# EAGLE design linear_DC_voltage_reg (EAGLE 9.6.2)
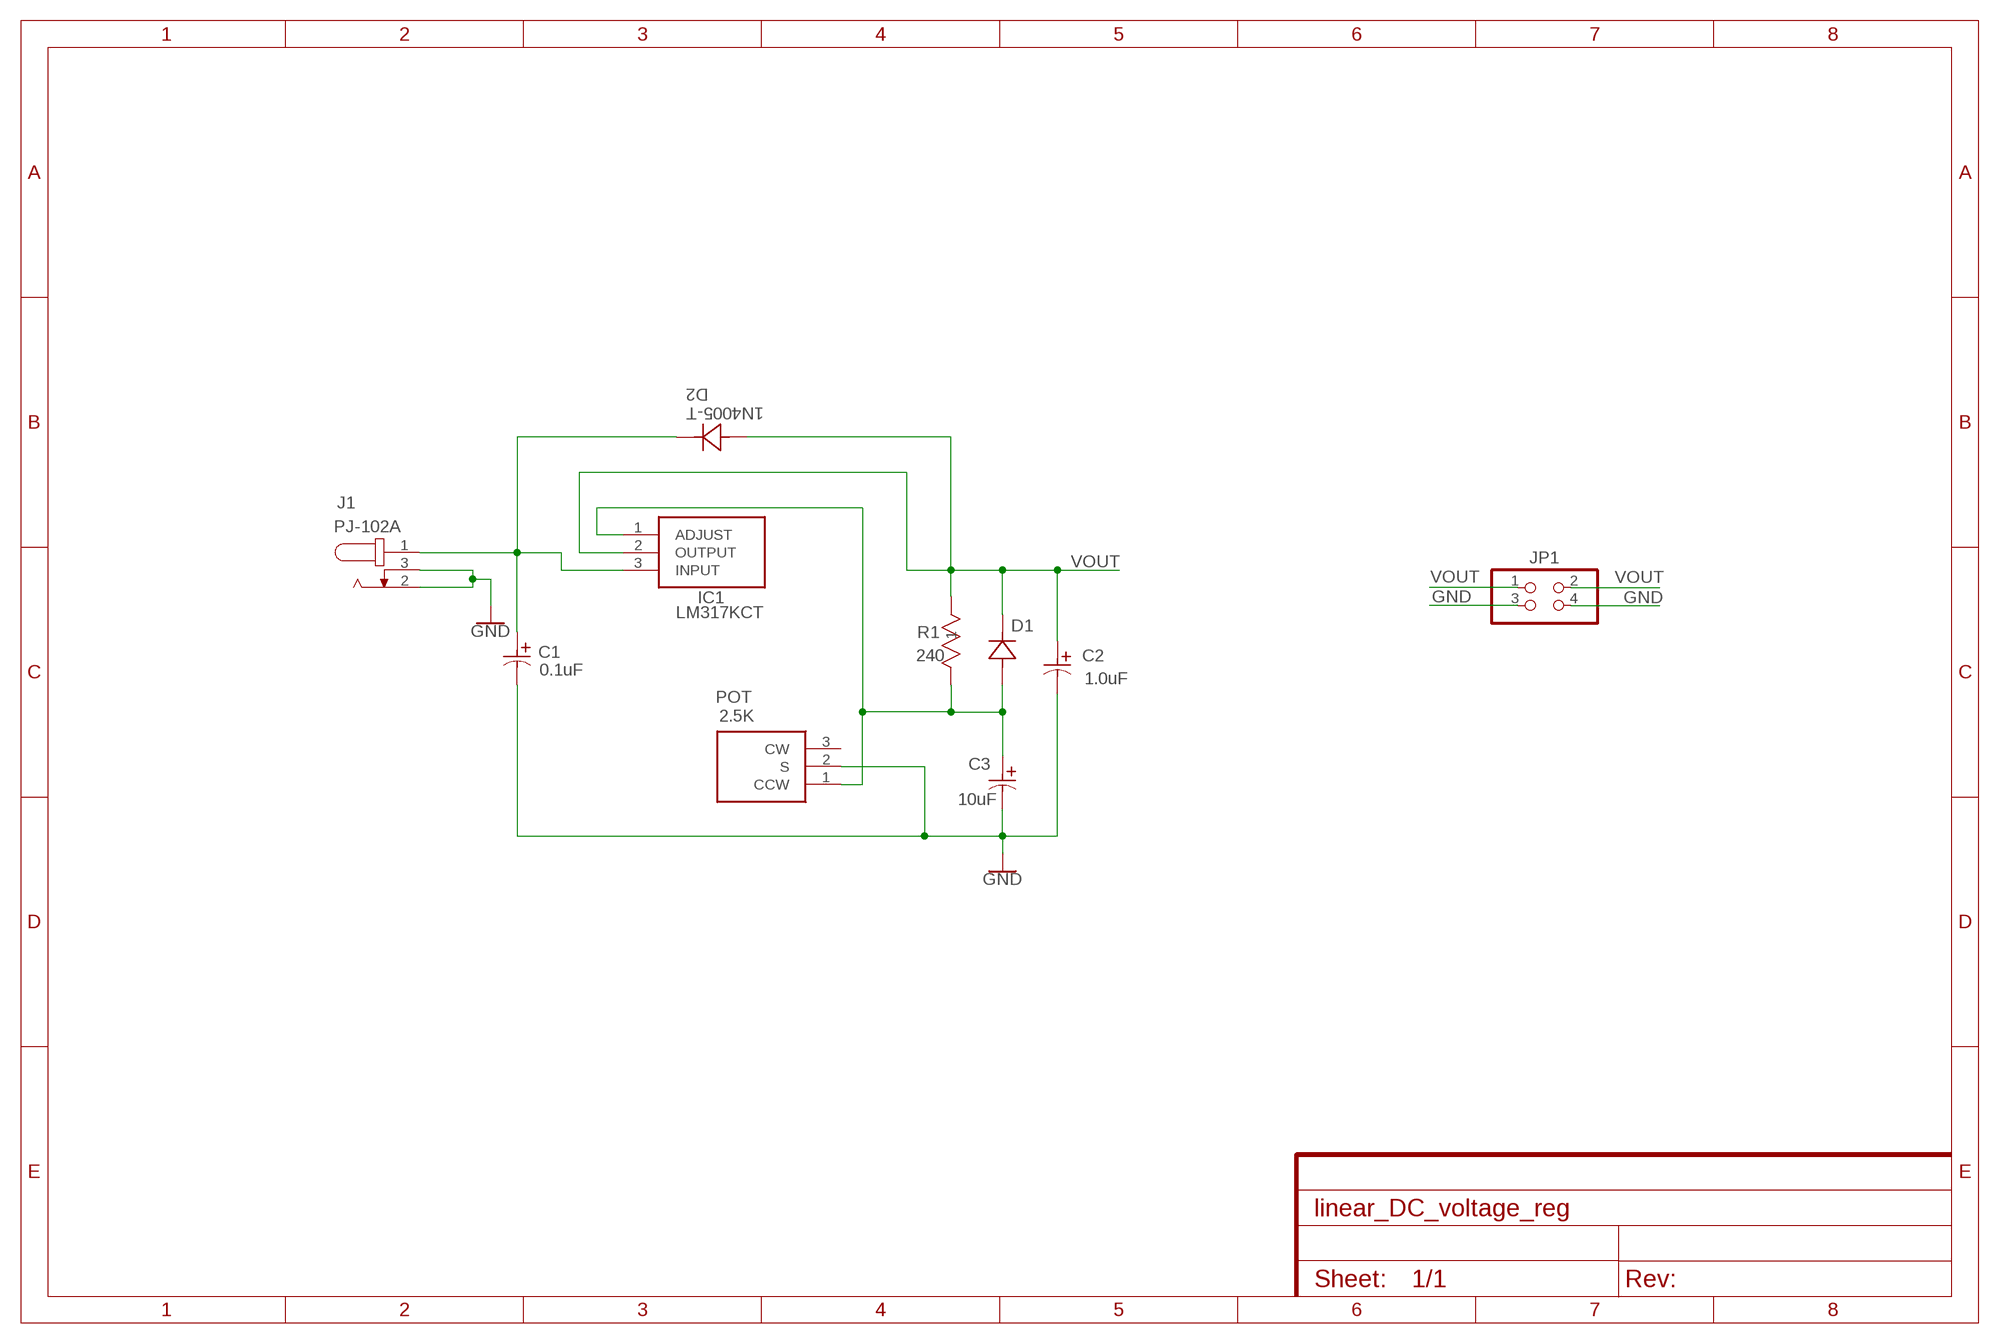
[diagram p0: schematic, sheet 1]

## Parts
C1  0.1uF  C322C104K5R5TA  [CAP_C322_KEM]
C2  1.0uF  C322C104K5R5TA  [CAP_C322_KEM]
C3  10uF  C322C104K5R5TA  [CAP_C322_KEM]
D1  1N4005-T  [DO-41_DIO]
D2  1N4005-T  [DO-41_DIO]
IC1  LM317KCT  [TO254P465X1016X1883-3P]
J1  PJ-102A  [CUI_PJ-102A]
JP1  PINHD-2X2  [2X02]
POT  2.5K  P160KN-0FC18C2K5  [P160KN0FC18C2K5]
R1  240  CFM12JT240R  [STA_CFM12_STP]

## Nets
GND: C1.2 C2.2 C3.2 J1.2 J1.3 JP1.3 JP1.4 POT.2(S)
VADJ: C3.1 D1.2 IC1.1(ADJUST) POT.1(CCW) R1.2
VIN: C1.1 D2.1 IC1.3(INPUT) J1.1
VOUT: C2.1 D1.1 D2.2 IC1.2(OUTPUT) JP1.1 JP1.2 R1.1
Unconnected: POT.3(CW)

## Library data of the parts
C1-C3 = CAP_C322:C322C104K5R5TA; COPYRIGHT: Copyright (C) 2021 Ultra Librarian. All rights reserved.; DIGI-KEY_PART_NUMBER_1: 399-4329-ND; MANUFACTURER_PART_NUMBER: C322C104K5R5TA; MFR_NAME: Kemet
D1 D2 = 1N4005_Diode:1N4005-T; COPYRIGHT: Copyright (C) 2021 Ultra Librarian. All rights reserved.; DIGI-KEY_PART_NUMBER_1: 1N4005DICT-ND; DIGI-KEY_PART_NUMBER_2: 1N4005DITR-ND; DIGI-KEY_PART_NUMBER_3: 1N4005DITR-NDL; MANUFACTURER_PART_NUMBER: 1N4005-T; MFR_NAME: Diodes Inc
IC1 = SamacSys_Parts:LM317KCT: 3-pin and 4-pin 1.5-A adjustable positive voltage regulator Source: Datasheet <http://www.ti.com/lit/gpn/lm317>; DESCRIPTION: 3-pin and 4-pin 1.5-A adjustable positive voltage regulator; HEIGHT: 4.65mm; MANUFACTURER_NAME: Texas Instruments; MANUFACTURER_PART_NUMBER: LM317KCT; MOUSER_PART_NUMBER: 595-LM317KCT; MOUSER_PRICE-STOCK: https://www.mouser.co.uk/ProductDetail/Texas-Instruments/LM317KCT?qs=TB%2FQ0sBK%2FGcz1btw204Pbw%3D%3D
J1 = barrel_jack_uno:PJ-102A: 2.0 mm Center Pin, 2.5 A, Right Angle, Through Hole, Tapered Pins, Dc Power Jack Connector; CUI_PURCHASE_URL: https://www.cuidevices.com/product/interconnect/connectors/dc-power-connectors/jacks/pj-102a?utm_source=snapeda.com&utm_medium=referral&utm_campaign=snapedaBOM; DESCRIPTION: 2.0 x 6.5 mm, 2.5 A, Horizontal, Through Hole, Tapered Pins, Dc Power Jack Connector; DIGI-KEY_PART_NUMBER: CP-102AH-ND; MF: CUI Devices; MP: PJ-102A; PACKAGE: None; PURCHASE-URL: https://pricing.snapeda.com/search/part/PJ-102A/?ref=eda
JP1 = pinhead:PINHD-2X2: PIN HEADER
POT = SamacSys_Parts:P160KN-0FC18C2K5: Potentiometers 16mm Rotary Panel Potentiometer Source: Datasheet <https://www.ttelectronics.com/TTElectronics/media/ProductFiles/Potentiometers/Datasheets/P160.pdf>; DESCRIPTION: Potentiometers 16mm Rotary Panel Potentiometer; HEIGHT: 16.5mm; MANUFACTURER_NAME: TT Electronics/BI Magnetics; MANUFACTURER_PART_NUMBER: P160KN-0FC18C2K5
R1 = res_CFM12_240:CFM12JT240R; COPYRIGHT: Copyright (C) 2021 Ultra Librarian. All rights reserved.; DIGI-KEY_PART_NUMBER_1: S240HCT-ND; DIGI-KEY_PART_NUMBER_2: S240HTR-ND; MANUFACTURER_PART_NUMBER: CFM12JT240R; MFR_NAME: Stackpole International

## Board
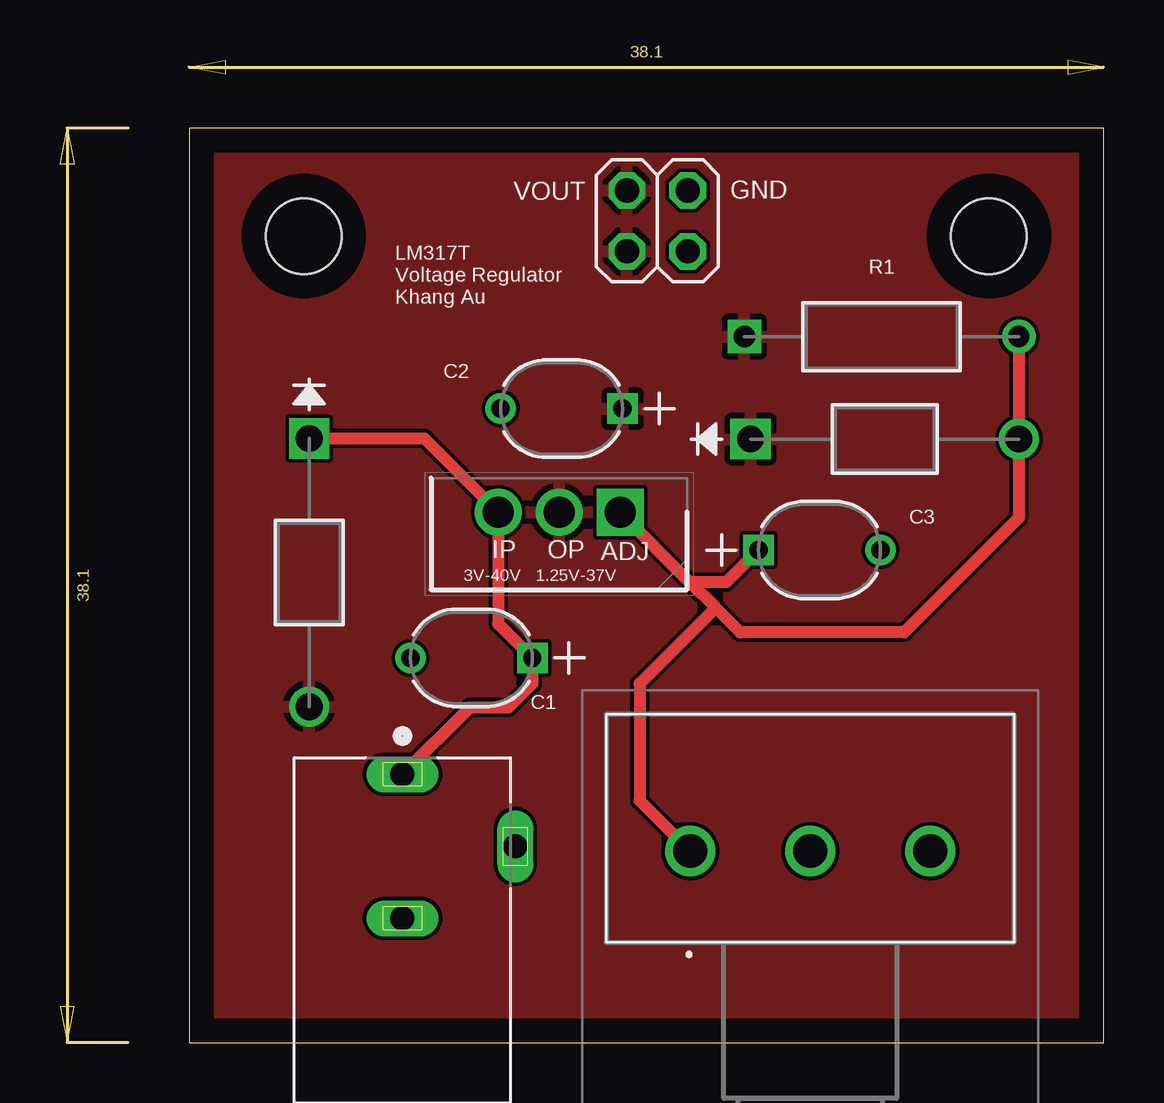
[diagram p1: board, top side]
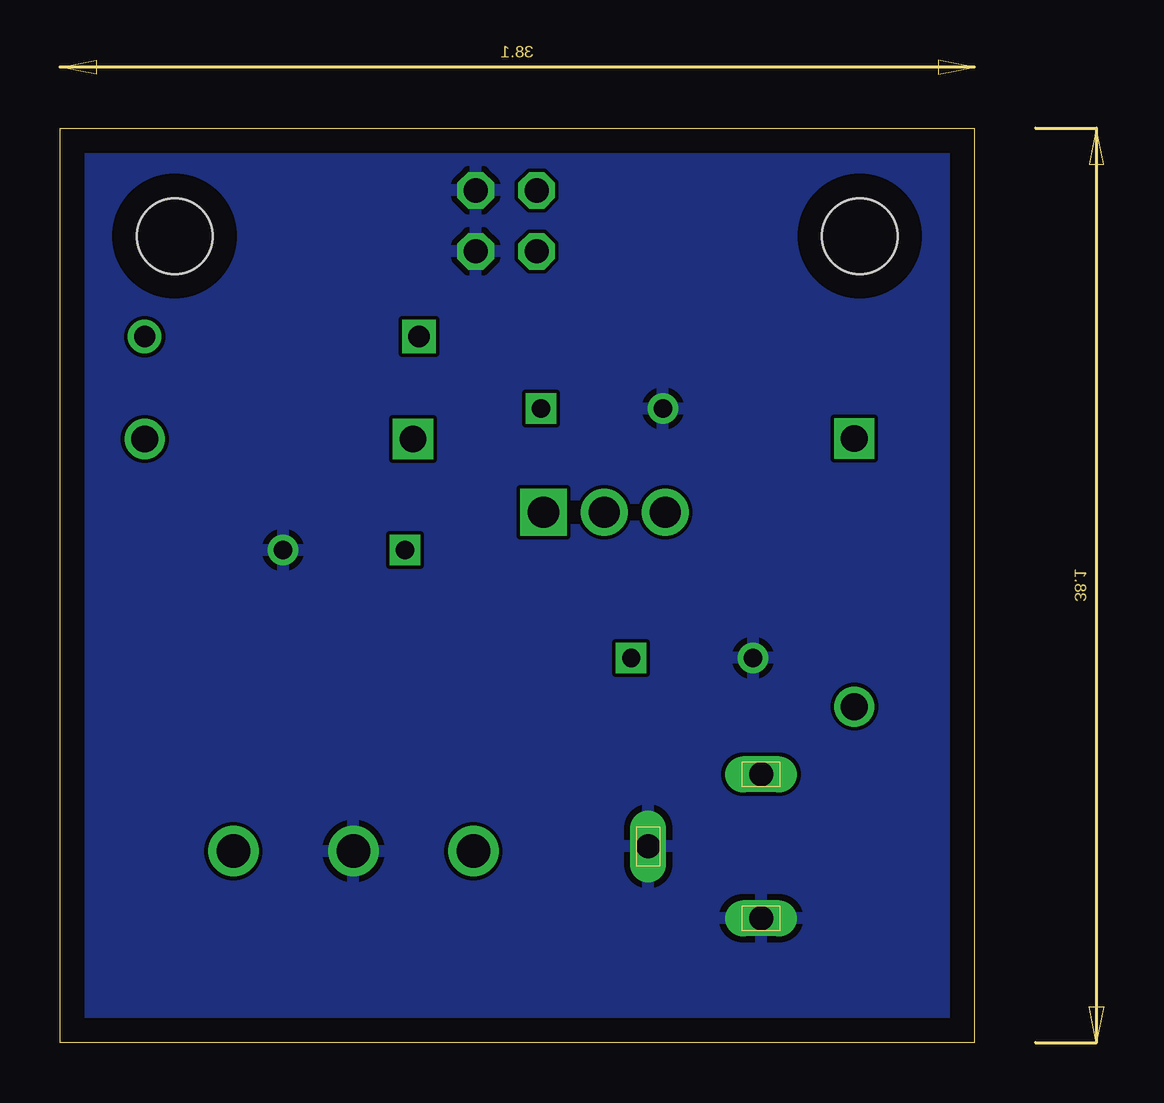
[diagram p2: board, bottom side, seen from below]

Size 38.1 x 38.1 mm. Coordinates in mm from the lower left corner, seen from the top.
Outline: 0,0 38.1,0 38.1,38.1 0,38.1 0,0
Copper layers (1*16): Top 0.035mm / dielectric 1.5mm / Bottom 0.035mm
Design rules "default": minimum track width 6mil, minimum drill 0.35mm, track to track 6mil, track to pad 6mil, pad to pad 6mil, via to via 6mil, smd to smd 6mil, copper to edge 40mil, drill to drill 6mil, minimum pad ring 10mil, minimum via ring 8mil, stop-mask expansion 4mil, vias tented up to drill 0mil, thermal gap 10mil
Holes 3.15 mm at 33.32,33.6 4.78,33.6

### Footprints (pad centres in the part's own frame; a part is rotated, then mirrored left to right if it is on the bottom)
CAP_C322_KEM = drill 0.762 pad 1.27 square: 1 0,0 | drill 0.762 pad 1.27: 2 5.08,0
DO-41_DIO = drill 1.118 pad 1.626 square: 1 0,0 | drill 1.118 pad 1.626: 2 11.176,0
TO254P465X1016X1883-3P = drill 1.3 pad 1.95 square: 1 0,0 | drill 1.3 pad 1.95: 2 2.54,0; 3 5.08,0
CUI_PJ-102A = drill 1 long: 1 -6.5,0; 2 -0.5,0; 3 -3.5,4.7
2X02 = drill 1.016 octagon: 1 -1.27,-1.27; 2 -1.27,1.27; 3 1.27,-1.27; 4 1.27,1.27
P160KN0FC18C2K5 = drill 1.4 pad 2.1: 1 0,0; 2 5,0; 3 10,0
STA_CFM12_STP = drill 0.889 pad 1.397 square: 1 0,0 | drill 0.889 pad 1.397: 2 11.43,0

### Placement (x,y rotation side)
C1  14.3,16.03 180 top
C2  18.06,26.42 180 top
C3  23.72,20.52 0 top
D1  23.39,25.15 0 top
D2  5,25.17 270 top
IC1  17.96,22.1 180 top
J1  8.89,4.67 270 top
JP1  19.51,34.24 0 top
POT  20.88,7.98 0 top
R1  23.14,29.41 0 top

### Tracks (layer width: path | path; a pad name or v marks a point on that pad's centre or on a via)
GND
  pour Bottom: 0,0 0,38.1 38.1,38.1 38.1,0
VADJ
  Top 0.508: R1.2 D1.2 34.57,21.87 29.79,17.09 22.96,17.09 21.93,18.12 | 21.93,18.12 20.87,19.19 | 20.87,19.19 IC1.1 | POT.1 18.77,10.08 18.77,14.96 21.93,18.12 | C3.1 22.39,19.19 20.87,19.19
VIN
  Top 0.508: J1.1 11.69,13.97 13.31,13.97 14.3,14.96 C1.1 12.88,17.45 IC1.3 9.8,25.17 D2.1
VOUT
  pour Top: 0,0 0,38.1 38.1,38.1 38.1,0

### Text on the board
tPlace: VOUT | GND | LM317T / Voltage Regulator / Khang Au | IP | OP | ADJ | 3V-40V | 1.25V-37V